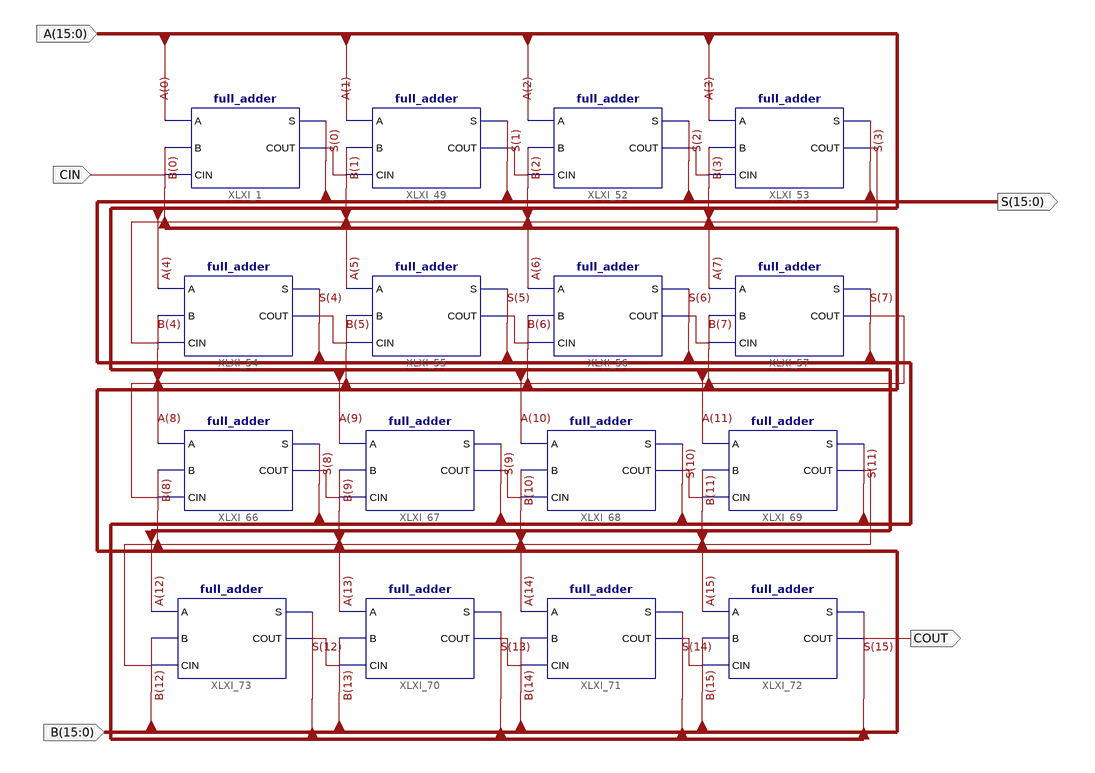
[diagram p0: schematic sheet 1]
// Xilinx ISE schematic full_adder_16bit.sch (spartan6) as structural Verilog: 16 symbols, 6 ports
module full_adder_16bit (
  inout  [15:0] B,
  input  CIN,
  input  [15:0] A,
  output COUT,
  output [15:0] S
);

  wire XL0, XL1, XL2, XL3, XLXN_4, XLXN_12, XLXN_19, XLXN_21, XLXN_22, XLXN_23, XLXN_24, XLXN_34, XLXN_35,
       XLXN_36, XLXN_42;

  full_adder XLXI_1 (.A(A[0]), .B(B[0]), .CIN(CIN), .COUT(XLXN_4), .S(S[0]));
  full_adder XLXI_49 (.A(A[1]), .B(B[1]), .CIN(XLXN_4), .COUT(XLXN_12), .S(S[1]));
  full_adder XLXI_52 (.A(A[2]), .B(B[2]), .CIN(XLXN_12), .COUT(XLXN_19), .S(S[2]));
  full_adder XLXI_54 (.A(A[4]), .B(B[4]), .CIN(XLXN_24), .COUT(XLXN_21), .S(S[4]));
  full_adder XLXI_55 (.A(A[5]), .B(B[5]), .CIN(XLXN_21), .COUT(XLXN_22), .S(S[5]));
  full_adder XLXI_56 (.A(A[6]), .B(B[6]), .CIN(XLXN_22), .COUT(XLXN_23), .S(S[6]));
  full_adder XLXI_57 (.A(A[7]), .B(B[7]), .CIN(XLXN_23), .COUT(XLXN_42), .S(S[7]));
  full_adder XLXI_66 (.A(A[8]), .B(B[8]), .CIN(XLXN_42), .COUT(XLXN_34), .S(S[8]));
  full_adder XLXI_67 (.A(A[9]), .B(B[9]), .CIN(XLXN_34), .COUT(XLXN_35), .S(S[9]));
  full_adder XLXI_68 (.A(A[10]), .B(B[10]), .CIN(XLXN_35), .COUT(XLXN_36), .S(S[10]));
  full_adder XLXI_69 (.A(A[11]), .B(B[11]), .CIN(XLXN_36), .COUT(XL3), .S(S[11]));
  full_adder XLXI_70 (.A(A[13]), .B(B[13]), .CIN(XL2), .COUT(XL1), .S(S[13]));
  full_adder XLXI_71 (.A(A[14]), .B(B[14]), .CIN(XL1), .COUT(XL0), .S(S[14]));
  full_adder XLXI_72 (.A(A[15]), .B(B[15]), .CIN(XL0), .COUT(COUT), .S(S[15]));
  full_adder XLXI_73 (.A(A[12]), .B(B[12]), .CIN(XL3), .COUT(XL2), .S(S[12]));
  full_adder XLXI_53 (.A(A[3]), .B(B[3]), .CIN(XLXN_19), .COUT(XLXN_24), .S(S[3]));
endmodule
